# Altium schematic sheet Esquematico1.SchDoc
size A4
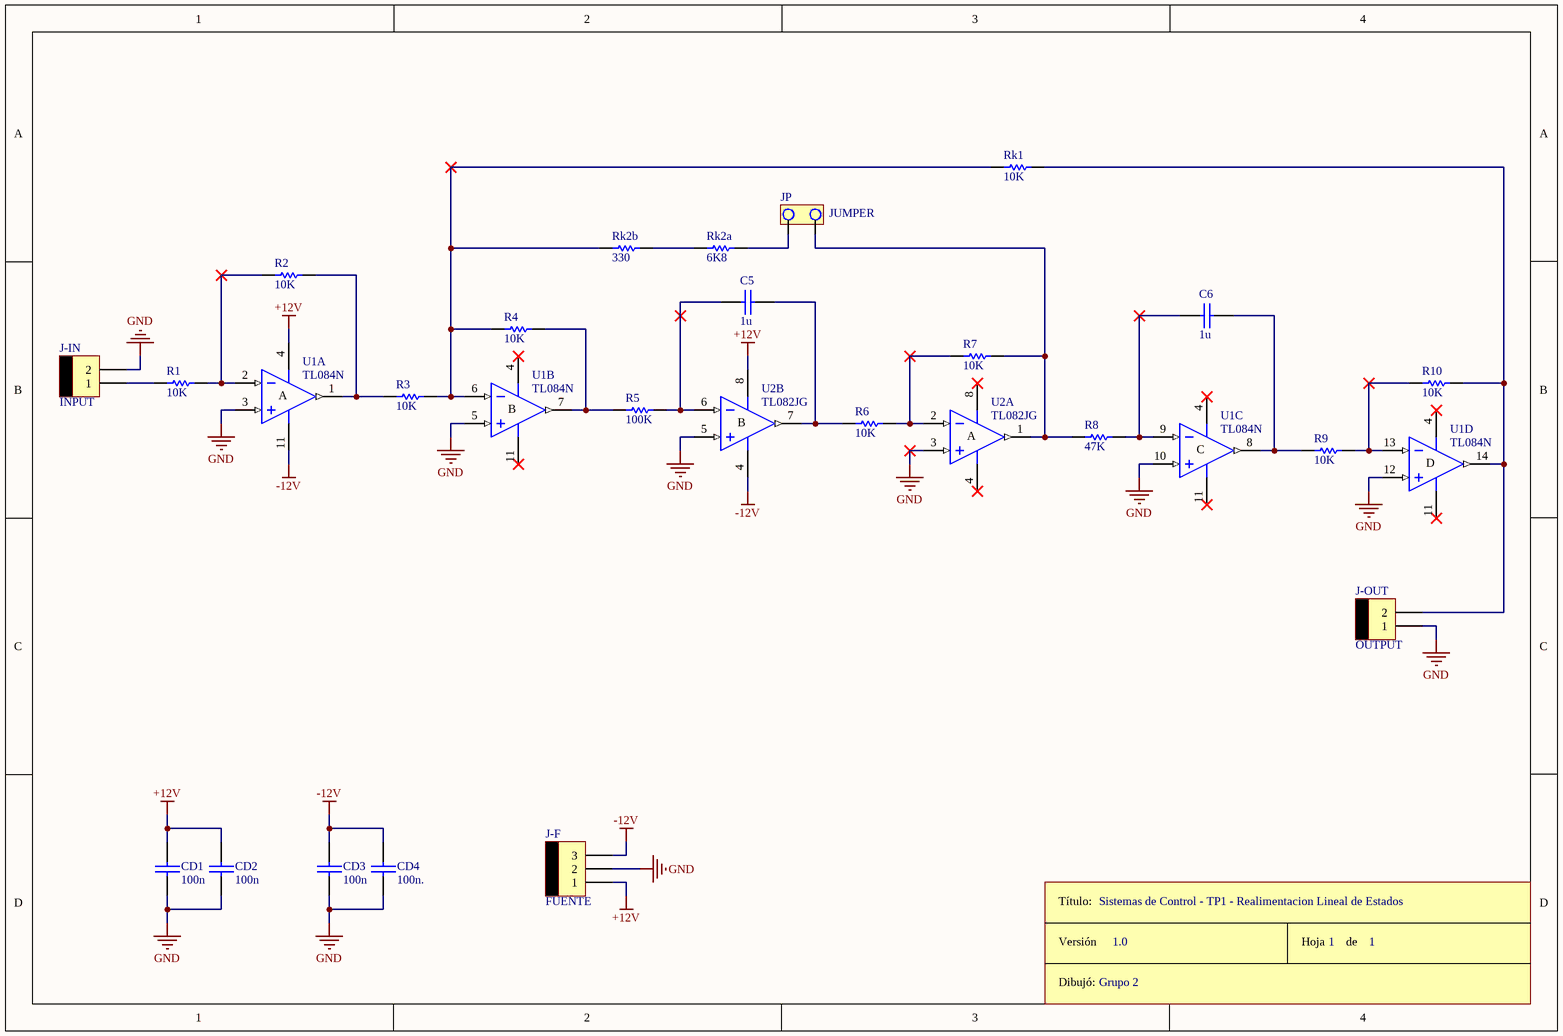
[diagram p0: Esquematico1.SchDoc]

## Parts
C5  1u  [CAP100]
C6  1u  [CAP100]
CD1  100n  [CAP100]
CD2  100n  [CAP100]
CD3  100n  [CAP100]
CD4  100n.  [CAP100]
J-F  FUENTE  [MOLEX3]
J-IN  INPUT  [MOLEX2]
J-OUT  OUTPUT  [MOLEX2]
JP  JUMPER  [JUMPER2]
R1  10K  [RES400]
R2  10K  [RES400]
R3  10K  [RES400]
R4  10K  [RES400]
R5  100K  [RES400]
R6  10K  [RES400]
R7  10K  [RES400]
R8  47K  [RES400]
R9  10K  [RES400]
R10  10K  [RES400]
Rk1  10K  [RES400]
Rk2a  6K8  [RES400]
Rk2b  330  [RES400]
ROT1  Rótulo  (value not drawn)
U1  TL084N  [N014]  (parts A,B,C,D of 4)
U2  TL082JG  [JG008]  (parts A,B of 2)

## Nets
+12V: CD1.1 CD2.1 J-F.1 U1.4(V+) U2.8(V+)
-12V: CD3.1 CD4.1 J-F.3 U1.11(V-) U2.4(V-)
GND: CD1.2 CD2.2 CD3.2 CD4.2 J-F.2 J-IN.2 J-OUT.1 U1.3(IN+) U1.5(IN+) U1.10(IN+) U1.12(IN+) U2.3(IN+) U2.5(IN+)
NetC5_1: C5.1 R5.2 U2.6(IN-)
NetC5_2: C5.2 R6.1 U2.7(OUT)
NetC6_1: C6.1 R8.2 U1.9(IN-)
NetC6_2: C6.2 R9.1 U1.8(OUT)
NetJ-IN_1: J-IN.1 R1.1
NetJ-OUT_2: J-OUT.2 R10.2 Rk1.2 U1.14(OUT)
NetJP_1: JP.1 R7.2 R8.1 U2.1(OUT)
NetJP_2: JP.2 Rk2a.2
NetR1_2: R1.2 R2.1 U1.2(IN-)
NetR2_2: R2.2 R3.1 U1.1(OUT)
NetR3_2: R3.2 R4.1 Rk1.1 Rk2b.1 U1.6(IN-)
NetR4_2: R4.2 R5.1 U1.7(OUT)
NetR6_2: R6.2 R7.1 U2.2(IN-)
NetR9_2: R9.2 R10.1 U1.13(IN-)
NetRk2a_1: Rk2a.1 Rk2b.2

## Notes on the sheet
- Sistemas de Control - TP1 - Realimentacion Lineal de Estados
- Grupo 2
- 1.0
- 1
- (in symbol Rótulo) Título:; Versión; Hoja       de; Dibujó:
- (in symbol TL082JG, part A) A
- (in symbol TL082JG, part B) B
- (in symbol TL084N, part A) A
- (in symbol TL084N, part B) B
- (in symbol TL084N, part C) C
- (in symbol TL084N, part D) D

## Library data of the parts
C5 C6 CD1-CD4 = CAP
J-F = MOLEX3
J-IN J-OUT = MOLEX2
R1-R10 Rk1 Rk2a Rk2b = RES
U1 = TL084N: JFET-Input Operational Amplifier; Published: 16-Jan-2001; LatestRevisionDate: 04-Mar-2005; LatestRevisionNote: Stylized 3D Model Added.; DatasheetVersion: Feb-1999; PackageVersion: Oct-1995; PackageReference: N014; Publisher: Altium Limited; PackageDescription: DIP; 14 Leads; Row Spacing 7.62 mm; Pitch 2.54 mm; ComponentLink1Description: Manufacturer Link; ComponentLink1URL: http://www.ti.com/; ComponentLink2Description: Datasheet; ComponentLink2URL: http://www-s.ti.com/sc/ds/tl084.pdf
U2 = TL082JG: JFET-Input Operational Amplifier; Published: 16-Jan-2001; LatestRevisionDate: 04-Mar-2005; LatestRevisionNote: Stylized 3D Model Added.; DatasheetVersion: Feb-1999; PackageVersion: Jan-1995; PackageReference: JG008; Publisher: Altium Limited; PackageDescription: DIP; 8 Leads; Row Spacing 7.62 mm; Pitch 2.54 mm; ComponentLink1Description: Manufacturer Link; ComponentLink1URL: http://www.ti.com/; ComponentLink2Description: Datasheet; ComponentLink2URL: http://www-s.ti.com/sc/ds/tl082.pdf